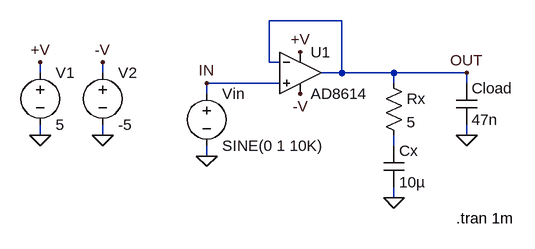
[diagram p0: schematic AD8614.asc]
AD8614.asc, the LTspice schematic file:
Version 4
SHEET 1 1240 700
WIRE 640 -1184 528 -1184
WIRE 528 -1120 528 -1184
WIRE 544 -1120 528 -1120
WIRE 176 -1104 176 -1120
WIRE 272 -1104 272 -1120
WIRE 640 -1104 640 -1184
WIRE 640 -1104 608 -1104
WIRE 720 -1104 640 -1104
WIRE 832 -1104 720 -1104
WIRE 544 -1088 432 -1088
WIRE 720 -1088 720 -1104
WIRE 832 -1088 832 -1104
WIRE 432 -1072 432 -1088
WIRE 176 -1008 176 -1024
WIRE 272 -1008 272 -1024
WIRE 832 -1008 832 -1024
WIRE 720 -992 720 -1008
WIRE 432 -976 432 -992
WIRE 720 -912 720 -928
FLAG 432 -976 0
FLAG 832 -1104 OUT
FLAG 432 -1088 IN
FLAG 576 -1136 +V
FLAG 576 -1072 -V
FLAG 720 -912 0
FLAG 832 -1008 0
FLAG 176 -1120 +V
FLAG 176 -1008 0
FLAG 272 -1120 -V
FLAG 272 -1008 0
SYMBOL voltage 432 -1088 R0
WINDOW 123 24 146 Left 2
WINDOW 39 24 125 Left 2
SYMATTR InstName Vin
SYMATTR Value SINE(0 1 10K)
SYMBOL Opamps\\AD8614 576 -1168 R0
SYMATTR InstName U1
SYMBOL cap 816 -1088 R0
SYMATTR InstName Cload
SYMATTR Value 47n
SYMBOL res 704 -1104 R0
SYMATTR InstName Rx
SYMATTR Value 5
SYMBOL cap 704 -992 R0
SYMATTR InstName Cx
SYMATTR Value 10µ
SYMBOL voltage 176 -1120 R0
WINDOW 123 0 0 Left 2
WINDOW 39 0 0 Left 2
SYMATTR InstName V1
SYMATTR Value 5
SYMBOL voltage 272 -1120 R0
WINDOW 123 24 146 Left 2
WINDOW 39 24 125 Left 2
SYMATTR InstName V2
SYMATTR Value -5
TEXT 816 -880 Left 2 !.tran 1m

The netlist it stands for:
* AD8614.asc
Vin IN 0 SINE(0 1 10K)
XU1 IN OUT +V -V OUT AD8614  ; pins In+ In- V+ V- OUT
Cload OUT 0 47n
Rx OUT N001 5
Cx N001 0 10µ
V1 +V 0 5
V2 -V 0 -5
.tran 1m
.backanno
.end